# EAGLE board EEZ PSU consolidated r5B13 (EAGLE 6.1), part 1 of 4
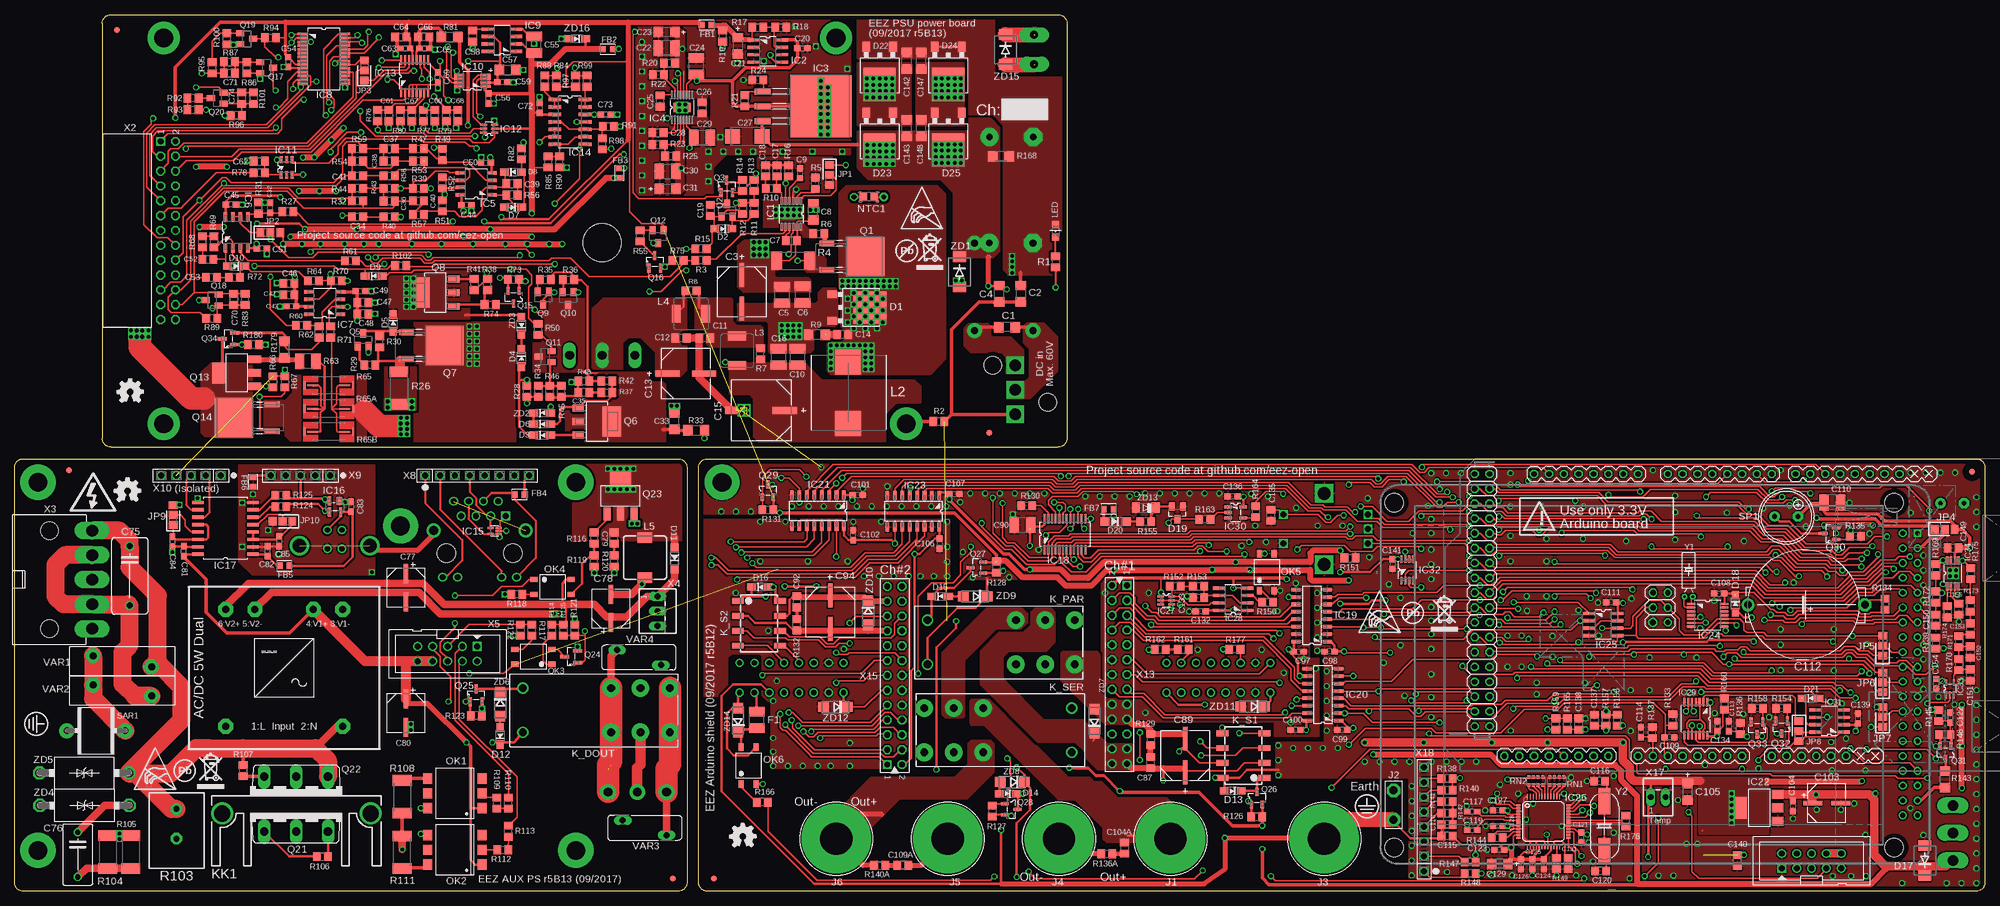
[diagram p12: board, top side]
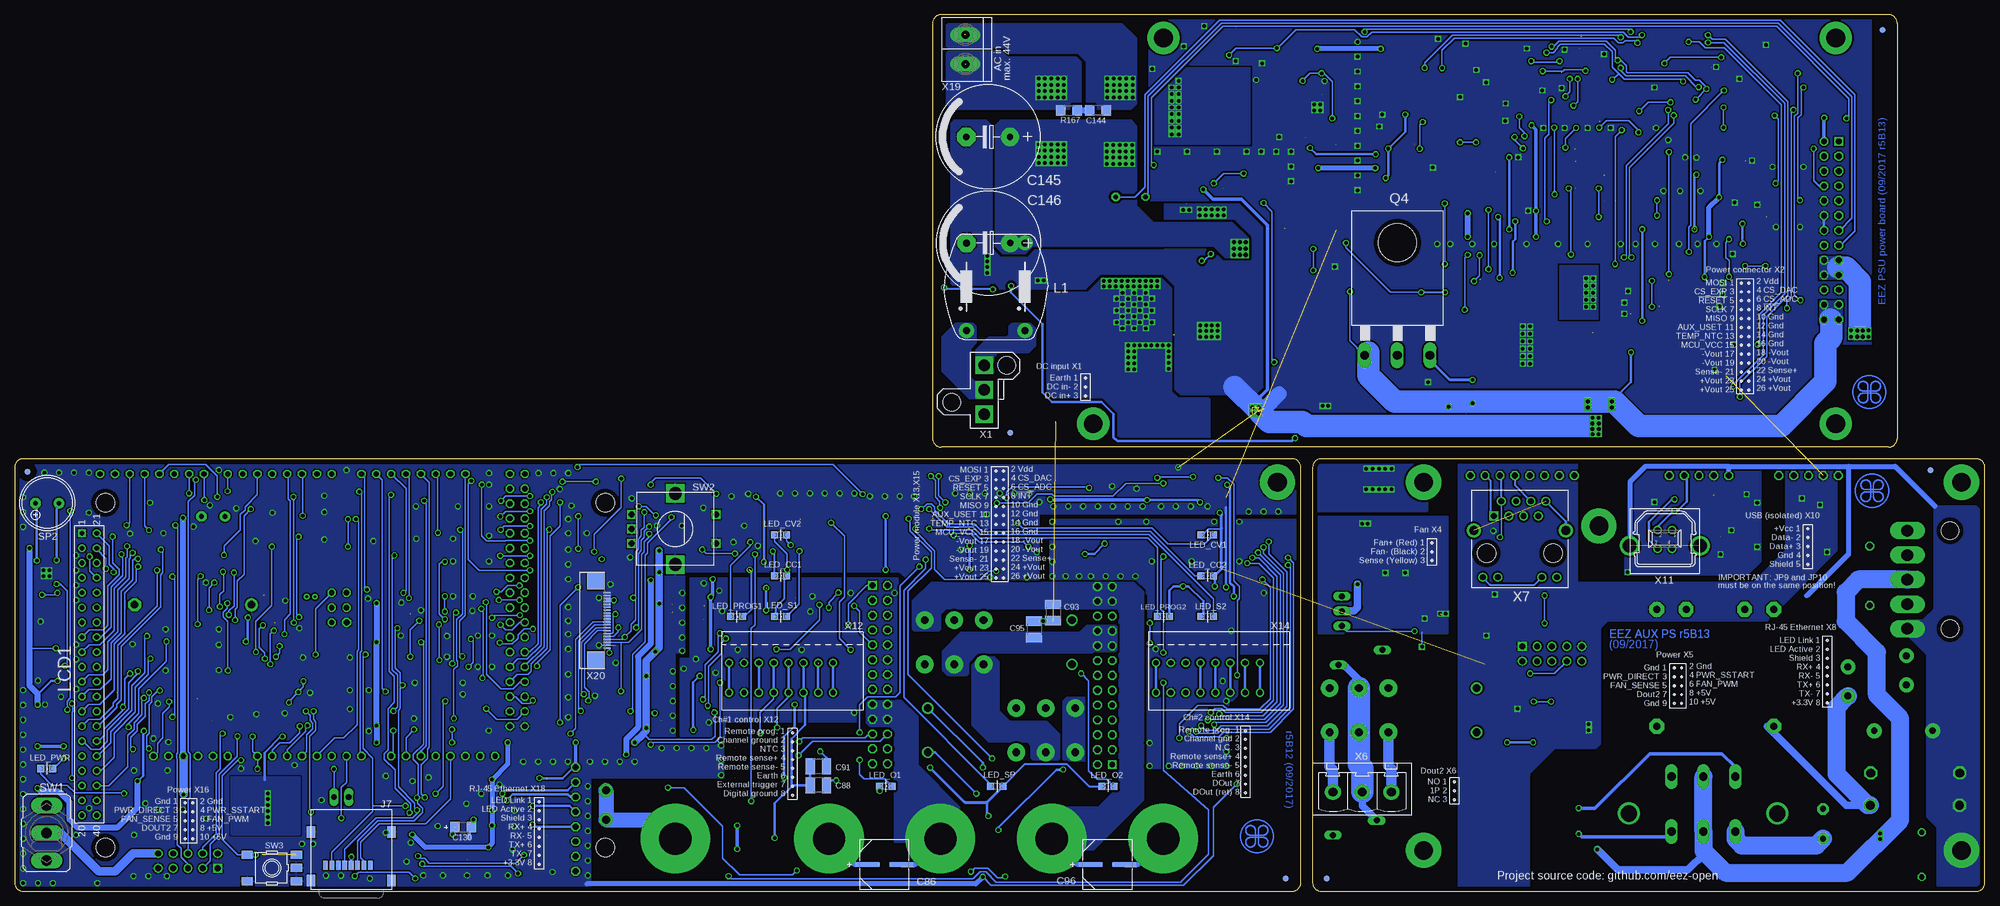
[diagram p13: board, bottom side, seen from below]

Size 337 x 150 mm. Coordinates in mm from the lower left corner, seen from the top.
Outline: 16.5,76 178.5,76 arc90 180,77.5 180,148.5 arc90 178.5,150 16.5,150 arc90 15,148.5 15,77.5 arc90 16.5,76
Outline: 1.5,74 113.5,74 arc-90 115,72.5 115,1.5 arc-90 113.5,0 1.5,0 arc-90 0,1.5 0,72.5 arc-90 1.5,74
Outline: 118.5,74 335.5,74 arc-90 337,72.5 337,1.5 arc-90 335.5,0 118.5,0 arc-90 117,1.5 117,72.5 arc-90 118.5,74
Copper layers (1*16): Top 0.035mm / dielectric 1.5mm / Bottom 0.035mm
Design rules: minimum track width 10mil, minimum drill 0.5mm, track to track 8mil, track to pad 8mil, pad to pad 8mil, via to via 8mil, smd to smd 8mil, copper to edge 30mil, drill to drill 8mil, minimum pad ring 10mil, minimum via ring 8mil, stop-mask expansion 4mil, vias tented up to drill 25mil, thermal gap 10mil
Net classes: 0 default: width 0.254 mm, drill 0.584 mm, clearance 0.254 mm; 1 dgnd: width 0.254 mm, drill 0.584 mm, clearance 0.254 mm; 2 gnd: width 0.254 mm, drill 0.584 mm, clearance 0.254 mm

## Footprints (pad centres in the part's own frame; a part is rotated, then mirrored left to right if it is on the bottom)
C1206 = smd 1.6 x 1.8: 1 -1.4,0; 2 1.4,0
CAPAE830X650N = smd 4.064 x 0.762: 1 -2.87,0; 2 2.87,0
C1210 = smd 1.6 x 2.7: 1 -1.4,0; 2 1.4,0
C0805 = smd 1.3 x 1.5: 1 -0.95,0; 2 0.95,0
C0603 = smd 1.1 x 1: 1 -0.85,0; 2 0.85,0
CAPAE830X1050N = smd 4.064 x 1.092: 1 -3.124,0; 2 3.124,0
PANASONIC_F = smd 4.166 x 1.194: 1 -4.064,0; 2 4.064,0
EC1206 = smd 1.6 x 1.8: + -1.4,0; - 1.4,0
C/6032-28R = smd 2.55 x 2.5: + 2.525,0; - -2.525,0
C102-064X133 = drill 1.016 octagon: 1 -5.08,0; 2 5.08,0
C075-052X106 = drill 0.914 octagon: 1 -3.81,0; 2 3.81,0
CAPAE660X610N = smd 3.251 x 0.762: 1 -2.413,0; 2 2.413,0
SG-R20MM = drill 1.3 pad 2.184 octagon: 1 10.389,0 | drill 1.3 pad 2.184: 2 -9.601,0
ECAP7.5/18 = drill 1.1 pad 3.14: + -3.75,0 | drill 1.1 pad 3.14 octagon: - 3.75,0
TO252 = smd 1.3 x 1.7: 1 -2.285,-5.49; 2 2.285,-5.49 | smd 5.5 x 5.7: 3 0,0.95
SOD323-W = smd 1.5 x 1.2: A 1.45,0; C -1.45,0
SOD123 = smd 1.4 x 1.4: A 1.9,0; C -1.9,0
DO214AA = smd 1.8 x 2.2: A 2.55,0; C -2.55,0
SOT23 = smd 1 x 1.4: 1 -0.95,-1.1; 2 0.95,-1.1; 3 0,1.1
TO252@1 = smd 1.3 x 1.7: 1 -2.285,-5.49; 2 2.285,-5.49 | smd 5.5 x 5.7: 3 0,0.95
F1210 = smd 1.6 x 2.7: 1 -1.4,0; 2 1.4,0
BEAD0603 = smd 1 x 1.1: P$1 -0.85,0; P$2 0.85,0
FIDUCIAL_DUAL = smd 1.016 x 1.016 bottom: B 0,0 | smd 1.016 x 1.016: T 0,0
LTC_05-08-1666 = smd 1.27 x 0.457: 1 -2.235,1.63; 2 -2.235,0.98; 3 -2.235,0.33; 4 -2.235,-0.33; 5 -2.235,-0.98; 6 -2.235,-1.63; 7 2.235,-1.63; 8 2.235,-0.98; 9 2.235,-0.33; 10 2.235,0.33; 11 2.235,0.98; 12 2.235,1.63 | smd 1.753 x 2.946: TP 0,0
SOIC127P600X175-8N = smd 1.981 x 0.559: 1 -2.464,1.905; 2 -2.464,0.635; 3 -2.464,-0.635; 4 -2.464,-1.905; 5 2.464,-1.905; 6 2.464,-0.635; 7 2.464,0.635; 8 2.464,1.905
TO254P1524X483-4N = smd 1.016 x 2.692: 1 -2.54,-9.804; 2 0,-9.804; 3 2.54,-9.804 | smd 10.592 x 10.465: 4 0,0.152
SOP50P490X110-17N = smd 1.397 x 0.279: 1 -2.184,1.753; 2 -2.184,1.245; 3 -2.184,0.762; 4 -2.184,0.254; 5 -2.184,-0.254; 6 -2.184,-0.762; 7 -2.184,-1.245; 8 -2.184,-1.753; 9 2.184,-1.753; 10 2.184,-1.245; 11 2.184,-0.762; 12 2.184,-0.254; 13 2.184,0.254; 14 2.184,0.762; 15 2.184,1.245; 16 2.184,1.753 | smd 1.651 x 2.845: 17 0,0
SOIC127P600X173-8N = smd 1.55 x 0.6: 1 -2.7,1.9; 2 -2.7,0.63; 3 -2.7,-0.64; 4 -2.7,-1.91; 5 2.7,-1.91; 6 2.7,-0.64; 7 2.7,0.63; 8 2.7,1.9
SOP65P780X200-28N = smd 1.651 x 0.432: 1 -3.632,4.216; 2 -3.632,3.581; 3 -3.632,2.921; 4 -3.632,2.286; 5 -3.632,1.626; 6 -3.632,0.965; 7 -3.632,0.33; 8 -3.632,-0.33; 9 -3.632,-0.965; 10 -3.632,-1.626; 11 -3.632,-2.286; 12 -3.632,-2.921; 13 -3.632,-3.581; 14 -3.632,-4.216; 15 3.632,-4.216; 16 3.632,-3.581; 17 3.632,-2.921; 18 3.632,-2.286; 19 3.632,-1.626; 20 3.632,-0.965; 21 3.632,-0.33; 22 3.632,0.33; 23 3.632,0.965; 24 3.632,1.626; 25 3.632,2.286; 26 3.632,2.921; 27 3.632,3.581; 28 3.632,4.216
DGK8-M = smd 1.727 x 0.483: 1 -2.235,0.965; 2 -2.235,0.33; 3 -2.235,-0.33; 4 -2.235,-0.965; 5 2.235,-0.965; 6 2.235,-0.33; 7 2.235,0.33; 8 2.235,0.965
SOT95P280X145-6N = smd 1.27 x 0.559: 1 -1.295,0.94; 2 -1.295,0; 3 -1.295,-0.94; 4 1.295,-0.94; 5 1.295,0; 6 1.295,0.94
SOT65P210X110-6N = smd 1.168 x 0.356: 1 -0.94,0.66; 2 -0.94,0; 3 -0.94,-0.66; 4 0.94,-0.66; 5 0.94,0; 6 0.94,0.66
PW(R-PDSO-G16) = smd 1.6 x 0.35: 1 -2.8,2.3; 2 -2.8,1.65; 3 -2.8,1; 4 -2.8,0.35; 5 -2.8,-0.3; 6 -2.8,-0.95; 7 -2.8,-1.6; 8 -2.8,-2.25; 9 2.8,-2.25; 10 2.8,-1.6; 11 2.8,-0.95; 12 2.8,-0.3; 13 2.8,0.35; 14 2.8,1; 15 2.8,1.65; 16 2.8,2.3
SOIC127P600X175-14N = smd 2.2 x 0.6: 1 -2.591,3.81; 2 -2.591,2.54; 3 -2.591,1.27; 4 -2.591,0; 5 -2.591,-1.27; 6 -2.591,-2.54; 7 -2.591,-3.81; 8 2.591,-3.81; 9 2.591,-2.54; 10 2.591,-1.27; 11 2.591,0; 12 2.591,1.27; 13 2.591,2.54; 14 2.591,3.81
DRL5 = smd 1.016 x 0.305: 1 -0.699,0.5; 2 -0.699,0; 3 -0.699,-0.5; 4 0.699,-0.5; 5 0.699,0.5
SOP192P292X122-4N = smd 0.94 x 1.321: 1 -0.762,-1.016 | smd 0.559 x 1.575: 2 0.965,-1.016; 3 0.965,0.889; 4 -0.965,0.889
SOIC-16W = smd 1.981 x 0.559: 1 -4.699,4.445; 2 -4.699,3.175; 3 -4.699,1.905; 4 -4.699,0.635; 5 -4.699,-0.635; 6 -4.699,-1.905; 7 -4.699,-3.175; 8 -4.699,-4.445; 9 4.699,-4.445; 10 4.699,-3.175; 11 4.699,-1.905; 12 4.699,-0.635; 13 4.699,0.635; 14 4.699,1.905; 15 4.699,3.175; 16 4.699,4.445
SOP63P600X175-24N = smd 1.6 x 0.356: 1 -2.667,3.505; 2 -2.667,2.845; 3 -2.667,2.235; 4 -2.667,1.575; 5 -2.667,0.965; 6 -2.667,0.305; 7 -2.667,-0.305; 8 -2.667,-0.965; 9 -2.667,-1.575; 10 -2.667,-2.235; 11 -2.667,-2.845; 12 -2.667,-3.505; 13 2.667,-3.505; 14 2.667,-2.845; 15 2.667,-2.235; 16 2.667,-1.575; 17 2.667,-0.965; 18 2.667,-0.305; 19 2.667,0.305; 20 2.667,0.965; 21 2.667,1.575; 22 2.667,2.235; 23 2.667,2.845; 24 2.667,3.505
SOIC-16 = smd 1.549 x 0.61: 1 -2.692,4.445; 2 -2.692,3.175; 3 -2.692,1.905; 4 -2.692,0.635; 5 -2.692,-0.635; 6 -2.692,-1.905; 7 -2.692,-3.175; 8 -2.692,-4.445; 9 2.692,-4.445; 10 2.692,-3.175; 11 2.692,-1.905; 12 2.692,-0.635; 13 2.692,0.635; 14 2.692,1.905; 15 2.692,3.175; 16 2.692,4.445
SOT223 = smd 1.5 x 2: 1 -2.3,-3.15; 2 0,-3.15; 3 2.3,-3.15 | smd 3.8 x 2: 4 0,3.15
SOP65P640X120-14N = smd 1.473 x 0.356: 1 -2.819,1.956; 2 -2.819,1.295; 3 -2.819,0.66; 4 -2.819,0; 5 -2.819,-0.66; 6 -2.819,-1.295; 7 -2.819,-1.956; 8 2.819,-1.956; 9 2.819,-1.295; 10 2.819,-0.66; 11 2.819,0; 12 2.819,0.66; 13 2.819,1.295; 14 2.819,1.956
TQFP48-7X7 = smd 0.85 x 0.32: 1 -4.275,2.75; 2 -4.275,2.25; 3 -4.275,1.75; 4 -4.275,1.25; 5 -4.275,0.75; 6 -4.275,0.25; 7 -4.275,-0.25; 8 -4.275,-0.75; 9 -4.275,-1.25; 10 -4.275,-1.75; 11 -4.275,-2.25; 12 -4.275,-2.75; 25 4.275,-2.75; 26 4.275,-2.25; 27 4.275,-1.75; 28 4.275,-1.25; 29 4.275,-0.75; 30 4.275,-0.25; 31 4.275,0.25; 32 4.275,0.75; 33 4.275,1.25; 34 4.275,1.75; 35 4.275,2.25; 36 4.275,2.75 | smd 0.32 x 0.85: 13 -2.75,-4.275; 14 -2.25,-4.275; 15 -1.75,-4.275; 16 -1.25,-4.275; 17 -0.75,-4.275; 18 -0.25,-4.275; 19 0.25,-4.275; 20 0.75,-4.275; 21 1.25,-4.275; 22 1.75,-4.275; 23 2.25,-4.275; 24 2.75,-4.275; 37 2.75,4.275; 38 2.25,4.275; 39 1.75,4.275; 40 1.25,4.275; 41 0.75,4.275; 42 0.25,4.275; 43 -0.25,4.275; 44 -0.75,4.275; 45 -1.25,4.275; 46 -1.75,4.275; 47 -2.25,4.275; 48 -2.75,4.275
SOT95P280X145-5N = smd 1.27 x 0.559: 1 -1.295,0.94; 2 -1.295,0; 3 -1.295,-0.94; 4 1.295,-0.94; 5 1.295,0.94
SOP65P400X130-8N = smd 1.321 x 0.356: 1 -1.829,0.965; 2 -1.829,0.33; 3 -1.829,-0.33; 4 -1.829,-0.965; 5 1.829,-0.965; 6 1.829,-0.33; 7 1.829,0.33; 8 1.829,0.965
SOT65P210X110-5N = smd 1.168 x 0.356: 1 -1.041,0.66; 2 -1.041,0; 3 -1.041,-0.66; 4 1.041,-0.66; 5 1.041,0.66
SOP65P490X110-9N = smd 1.422 x 0.432: 1 -2.184,0.965; 2 -2.184,0.33; 3 -2.184,-0.33; 4 -2.184,-0.965; 5 2.184,-0.965; 6 2.184,-0.33; 7 2.184,0.33; 8 2.184,0.965 | smd 1.575 x 1.88: TP 0,0
BP_5_12 = drill 5.5 pad 11.9: P$1 0,0
PCB_TAB-4.8MM = drill 1.4 pad 2.3 octagon: P$1 -2.54,0; P$2 2.46,0
693072010801 = smd 0.8 x 1.5: 1 7.7,0; 2 6.6,0; 3 5.5,0; 4 4.4,0; 5 3.3,0; 6 2.2,0; 7 1.1,0; 8 0,0 | smd 1.45 x 2: Z1 -2.45,5.7; Z2 11.3,5.7; Z3 -2.45,-2.6; Z4 11.3,-2.6
A0R-JMP = smd 1.5 x 1.3: 1 0,1.7; 2 0,0; 3 0,-1.7
RT-C/016A5_ROUND = drill 1.3 pad 3: 11A 8.83,3.78; 11B 8.83,-3.78; 12A 3.79,3.78; 12B 3.79,-3.78; 14A 13.87,3.78; 14B 13.87,-3.78 | drill 1.3: A1 -11.33,-3.78; A2 -11.33,3.78
G6K-2F = smd 1 x 2: 1 -3.81,-3.6; 2 -1.27,-3.6; 3 1.27,-3.6; 4 3.81,-3.6; 5 3.81,3.6; 6 1.27,3.6; 7 -1.27,3.6; 8 -3.81,3.6
SK145 = drill 2.8: 1 -12.7,0; 2 12.7,0
RN112 = drill 1.2 pad 2.54: 1 -7.5,5; 2 7.5,5; 3 -7.5,-5; 4 7.5,-5
WE-HCI_1350/1365 = smd 4.25 x 4.5: 1 -5.25,0; 2 5.27,0
IHLP-2020BZ-11 = smd 3.048 x 1.524: 1 0,2.515; 2 0,-2.515
DE0704 = smd 2.5 x 1.8: 1 0,3.45; 2 0,-3.45
LCD_TFT_9341_MIRROR = drill 0.8 square: 1 48.26,0 | drill 0.8: 2 45.72,0; 3 43.18,0; 4 40.64,0; 5 38.1,0; 6 35.56,0; 7 33.02,0; 8 30.48,0; 9 27.94,0; 10 25.4,0; 11 22.86,0; 12 20.32,0; 13 17.78,0; 14 15.24,0; 15 12.7,0; 16 10.16,0; 17 7.62,0; 18 5.08,0; 19 2.54,0; 20 0,0; 21 48.26,2.54; 22 45.72,2.54; 23 43.18,2.54; 24 40.64,2.54; 25 38.1,2.54; 26 35.56,2.54; 27 33.02,2.54; 28 30.48,2.54; 29 27.94,2.54; 30 25.4,2.54; 31 22.86,2.54; 32 20.32,2.54; 33 17.78,2.54; 34 15.24,2.54; 35 12.7,2.54; 36 10.16,2.54; 37 7.62,2.54; 38 5.08,2.54; 39 2.54,2.54; 40 0,2.54 | hole 3.2: -5.5,4; 53.5,4; -5.5,89.5; 53.5,89.5
LED_HSMH-C170 = smd 1.2 x 1.2: A 0,1.05; C 0,-1.05
LED_0805 = smd 1.2 x 1.2: A 0,-1.05; C 0,1.05
ARDUINO+ICSP_MIRROR = drill 0.9 octagon: 0 63.5,2.54; 1 60.96,2.54; 2 58.42,2.54; 3 55.88,2.54; 3.3V 35.56,50.8; 4 53.34,2.54; 5 50.8,2.54; 5V 38.1,50.8; 5V(1) 93.98,2.54; 5V(2) 96.52,2.54; 6 48.26,2.54; 7 45.72,2.54; 8 41.656,2.54; 9 39.116,2.54; 10 36.576,2.54; 11 34.036,2.54; 12 31.496,2.54; 13 28.956,2.54; 14 68.58,2.54; 15 71.12,2.54; 16 73.66,2.54; 17 76.2,2.54; 18 78.74,2.54; 19 81.28,2.54; 20 83.82,2.54; 21 86.36,2.54; 22 93.98,5.08; 23 96.52,5.08; 24 93.98,7.62; 25 96.52,7.62; 26 93.98,10.16; 27 96.52,10.16; 28 93.98,12.7; 29 96.52,12.7; 30 93.98,15.24; 31 96.52,15.24; 32 93.98,17.78; 33 96.52,17.78; 34 93.98,20.32; 35 96.52,20.32; 36 93.98,22.86; 37 96.52,22.86; 38 93.98,25.4; 39 96.52,25.4; 40 93.98,27.94; 41 96.52,27.94; 42 93.98,30.48; 43 96.52,30.48; 44 93.98,33.02; 45 96.52,33.02; 46 93.98,35.56; 47 96.52,35.56; 48 93.98,38.1; 49 96.52,38.1; 50 93.98,40.64; 51 96.52,40.64; 52 93.98,43.18; 53 96.52,43.18; A0 50.8,50.8; A1 53.34,50.8; A2 55.88,50.8; A3 58.42,50.8; A4 60.96,50.8; A5 63.5,50.8; A6 66.04,50.8; A7 68.58,50.8; A8 73.66,50.8; A9 76.2,50.8; A10 78.74,50.8; A11 81.28,50.8; A12 83.82,50.8; A13 86.36,50.8; A14 88.9,50.8; A15 91.44,50.8; AREF 23.876,2.54; GND 26.416,2.54; GND1 40.64,50.8; GND2 43.18,50.8; GND3 93.98,45.72; GND4 96.52,45.72; ICSP_+5V 66.04,22.86; ICSP_MISO 63.5,22.86; ICSP_MOSI 66.04,25.4; ICSP_RESET 63.5,27.94; ICSP_SCK 63.5,25.4; RESET 33.02,50.8; VIN 45.72,50.8 | drill 1.016 octagon: ICSP_GND 66.04,27.94
R_0204/5+0805 = smd 1.3 x 1.5: 1 -0.95,0; 2 0.95,0 | drill 0.813 octagon: 1.1 -2.54,0 | drill 0.8 pad 1.422 octagon: 2.1 2.54,0
DIL6-SMD = smd 1.78 x 1.52: 1 -2.54,-4.645; 2 0,-4.645; 3 2.54,-4.645; 4 2.54,4.645; 5 0,4.645; 6 -2.54,4.645
HCPL-181 = smd 0.889 x 1.27: 1 -1.27,-3.175; 2 1.27,-3.175; 3 1.27,3.175; 4 -1.27,3.175
TO229P990X239-3N = smd 0.94 x 2.489: 1 -2.286,-6.401; 3 2.286,-6.401 | smd 6.731 x 6.528: 2 0,0.152
SOT23-BEC = smd 1 x 1.4: B -0.95,-1.1; C 0,1.1; E 0.95,-1.1
SOT103P240X110-3N = smd 1.524 x 0.559: 1 -1.079,1.016; 2 -1.079,-1.016; 3 1.079,0
TO247BH-CLR = drill 1.499 long: D 0,-19.304; G -5.588,-19.304; S 5.588,-19.304 | hole 6.5: 0,0
SOT230P700X180-4N = smd 1.905 x 1.143: 1 -3.2,2.311; 2 -3.2,0; 3 -3.2,-2.311 | smd 3.175 x 5.08: 4 2.565,0
SOT223' = smd 1.219 x 2.235: 1 -2.311,-3.099; 2 0,-3.099; 3 2.311,-3.099 | smd 3.6 x 2.2: 4 0,3.099
SOT95P237X112-3N = smd 1.321 x 0.559: 1 -1.092,0.94; 2 -1.092,-0.94; 3 1.092,0
TOP3S-1 = drill 1.397 long: A1 -5.461,-3.175; A2 0,-3.175; G 5.461,-3.175
R0805 = smd 1.3 x 1.5: 1 -0.95,0; 2 0.95,0
R2512 = smd 1.8 x 3.2: 1 -2.8,0; 2 2.8,0
R1206 = smd 1.6 x 1.803: 1 -1.422,0; 2 1.422,0
R1210 = smd 1.6 x 2.7: 1 -1.4,0; 2 1.4,0
R_2512-4WIRE = smd 0.254 x 1.27: 1 -4.191,0; 2 4.191,0 | smd 1.905 x 0.254: 1S -2.731,0; 2S 2.731,0
R_0913 = drill 1.016 pad 1.93 octagon: 1 -3.556,0; 2 1.524,0
CAY16 = smd 0.5 x 0.65: 1 -1.2,-0.675; 2 -0.4,-0.675; 3 0.4,-0.675; 4 1.2,-0.675; 5 1.2,0.675; 6 0.4,0.675; 7 -0.4,0.675; 8 -1.2,0.675
SAR = drill 1.1 pad 2.54: P$1 0,0; P$2 10,0
SHORT_NOHOLE = smd 0.5 x 0.25 bottom: P$1 0,0.117; P$2 0,-0.117
LD-BZEN-0903 = drill 0.8 pad 1.778 octagon: +B 2,0 | drill 0.8 pad 1.778: -B -2,0
M9040P = drill 1.803 long: 1 0,4.699; 2 0,0; 3 0,-4.699
EC12E_SW = drill 1 square: A -2.5,-7.5; B 2.5,-7.5; C 0,-7.5; D -2.5,7; E 2.5,7 | drill 2.2 square: GND1 -6.1,0; GND2 6.1,0
TACTM-6XN = smd 2.1 x 1.4: 1 -4.2,2.25; 2 4.2,2.25; 3 -4.2,-2.25; 4 4.2,-2.25; 5 -4.2,0
PCB_ACDC_VTX_5W_DUAL = drill 1.2 pad 2.54 octagon: 1 10,-10; 2 10,10; 3 -10,10; 4 -10,5; 5 -10,-5; 6 -10,-10
VARISTOR = drill 1.2 pad 2.54: P$1 -5,0.95; P$2 5,-0.95
VARISTOR_13MM = drill 1.016 long: 1 3.75,-1.27; 2 -3.75,1.27
MINIFIT_39301039 = drill 2 square: 1 0,0; 2 0,-4.2; 3 0,-8.4 | hole 3: 5.55,-2.1; -3.85,-8.4
SSW-113-02-T-D-RA = drill 1 pad 1.5 square: 1 30.48,2.54 | drill 1 pad 1.5 octagon: 2 30.48,0; 3 27.94,2.54; 4 27.94,0; 5 25.4,2.54; 6 25.4,0; 7 22.86,2.54; 8 22.86,0; 9 20.32,2.54; 10 20.32,0; 11 17.78,2.54; 12 17.78,0; 13 15.24,2.54; 14 15.24,0; 15 12.7,2.54; 16 12.7,0; 17 10.16,2.54; 18 10.16,0; 19 7.62,2.54; 20 7.62,0; 21 5.08,2.54; 22 5.08,0; 23 2.54,2.54; 24 2.54,0; 25 0,2.54; 26 0,0
MINIFIT_6659-5 = drill 2 pad 2.54 long: 1 0,-16.8; 2 0,-12.6; 3 0,-8.4; 4 0,-4.2; 5 0,0 | hole 3: -7.3,0; -7.3,-16.8
22-23-2031 = drill 1 long: 1 -2.54,0; 2 0,0; 3 2.54,0
IDC-10PIN = drill 1 pad 1.422 square: 1 -5.08,-1.27 | drill 1 pad 1.422: 2 -5.08,1.27; 3 -2.54,-1.27; 4 -2.54,1.27; 5 0,-1.27; 6 0,1.27; 7 2.54,-1.27; 8 2.54,1.27; 9 5.08,-1.27; 10 5.08,1.27
WR-TBL_3-PIN = drill 1.5 pad 2.7: 1 -5,0; 2 0,0; 3 5,0
RJ45-VERT = drill 1 square: 1 4.445,-5.08 | drill 1: 2 3.175,-7.62; 3 1.905,-5.08; 4 0.635,-7.62; 5 -0.635,-5.08; 6 -1.905,-7.62; 7 -3.175,-5.08; 8 -4.445,-7.62; 9 6.325,5.38; 10 3.785,5.38; 11 -3.785,5.38; 12 -6.325,5.38 | drill 1.6: SH1 7.875,-2.62; SH2 -7.875,-2.62 | hole 3.2: -5.715,1.27; 5.715,1.27
HEADER_8-PIN = drill 1 pad 1.5 octagon: 1 -8.89,0; 2 -6.35,0; 3 -3.81,0; 4 -1.27,0; 5 1.27,0; 6 3.81,0; 7 6.35,0; 8 8.89,0
SSW-105-02-S-S = drill 1 pad 1.5 octagon: 1 -5.08,0; 2 -2.54,0; 3 0,0; 4 2.54,0; 5 5.08,0
KUSBVX-BS1N = drill 0.9 pad 1.422: 1 1.25,2.7; 2 -1.25,2.7; 3 -1.25,-0.5; 4 1.25,-0.5 | drill 2.3 pad 2.7: M1 -6.02,0; M2 6.02,0
MC000006_MIRROR = drill 0.9: 1 0,0; 1.1 0,-5.08; 2 -2.54,0; 2.1 -2.54,-5.08; 3 -5.08,0; 3.1 -5.08,-5.08; 4 -7.62,0; 4.1 -7.62,-5.08; 5 -10.16,0; 5.1 -10.16,-5.08; 6 -12.7,0; 6.1 -12.7,-5.08; 7 -15.24,0; 7.1 -15.24,-5.08; 8 -17.78,0; 8.1 -17.78,-5.08
TSW-113-07-F-D = drill 1 pad 1.5 square: 1 30.48,0 | drill 1 pad 1.5 octagon: 2 30.48,2.54; 3 27.94,0; 4 27.94,2.54; 5 25.4,0; 6 25.4,2.54; 7 22.86,0; 8 22.86,2.54; 9 20.32,0; 10 20.32,2.54; 11 17.78,0; 12 17.78,2.54; 13 15.24,0; 14 15.24,2.54; 15 12.7,0; 16 12.7,2.54; 17 10.16,0; 18 10.16,2.54; 19 7.62,0; 20 7.62,2.54; 21 5.08,0; 22 5.08,2.54; 23 2.54,0; 24 2.54,2.54; 25 0,0; 26 0,2.54
22-23-2021 = drill 1 long: 1 -1.27,0; 2 1.27,0
TBLOCK5.0_2 = drill 1.35 pad 2.54 long: 1 0,0; 2 0,-5
FPC-20_ROTATED = smd 0.3 x 1.2: 1 4.75,2.217; 2 4.25,2.217; 3 3.75,2.217; 4 3.25,2.217; 5 2.75,2.217; 6 2.25,2.217; 7 1.75,2.217; 8 1.25,2.217; 9 0.75,2.217; 10 0.25,2.217; 11 -0.25,2.217; 12 -0.75,2.217; 13 -1.25,2.217; 14 -1.75,2.217; 15 -2.25,2.217; 16 -2.75,2.217; 17 -3.25,2.217; 18 -3.75,2.217; 19 -4.25,2.217; 20 -4.75,2.217 | smd 2.7 x 3: Z1 -6.68,0.318; Z2 6.68,0.318
R26_XTAL = drill 0.5: 1 -0.7,0; 2 0.7,0
HC-49/4H = smd 4.5 x 2: 1 -4.25,0; 2 4.25,0
DO201-BIDIR = drill 1.499 octagon: A 7.62,0; C -7.62,0
DO214AC = smd 1.8 x 1.7: A 2.05,0; C -2.05,0
MINIMELF = smd 1.4 x 1.8: A 1.7,0; C -1.7,0

## Placement (x,y rotation side)
C1  4n7/100V  [C1206]  169.73,96.52 180 top
C2  4n7/100V  [C1206]  172.08,102.23 270 top
C3  50SVPF18M  [CAPAE830X650N]  124.4,102.55 270 top
C4  4n7/100V  [C1206]  168.4,102.23 90 top
C5  4u7/100V  [C1210]  131.25,102.04 270 top
C6  4u7/100V  [C1210]  134.75,102.11 270 top
C7  470n  [C0805]  132.84,111.32 0 top
C8  1u/100V  [C1206]  136.59,116.27 90 top
C9  100n  [C0603]  134.37,122.87 270 top
C10  10u  [C1210]  133.92,91.44 90 top
C11  1u  [C0805]  118.05,94.68 180 top
C12  n.c.  [C0805]  113.98,94.68 0 top
C13  EEEFK1H470P  [CAPAE830X1050N]  114.81,88.58 0 top
C14  470p  [C0805]  141.67,95.25 180 top
C15  EEEFK1J101P  [PANASONIC_F]  127.7,82.3 180 top
C16  10u  [C1210]  130.68,91.44 90 top
C17  120p  [C0805]  130.43,123.25 90 top
C18  4n7  [C0805]  128.46,123.25 90 top
C19  470p  [C0805]  119,116.52 270 top
C20  100n  [C0603]  134.75,144.27 0 top
C21  4u7  [EC1206]  123.7,144.65 270 top
C22  10u  [C1210]  111.5,144.27 180 top
C23  10u  [EC1206]  111.5,147 180 top
C24  10u  [C1210]  116.58,141.16 90 top
C25  10n  [C0805]  110.43,135.19 90 top
C26  1u  [C0805]  117.6,134.05 270 top
C27  1uF/50V Tant.  [C/6032-28R]  125.35,129.16 0 top
C28  10n  [C0805]  110.04,129.79 0 top
C29  10u  [C1210]  117.6,128.97 0 top
C30  10u  [C1210]  111.7,123.19 0 top
C31  10u  [EC1206]  111.7,120.21 0 top
C32  100n  [C0603]  43.69,116.9 90 top
C33  1u/100V  [C1206]  112.84,80.45 90 top
C34  47p  [C0805]  58.67,115.38 0 top
C35  10n  [C0805]  97.34,85.34 180 top
C36  2n2  [C0805]  64.07,118.11 0 top
C37  2n2  [C0805]  64.07,127.06 0 top
C38  2n2  [C0805]  64.07,124.9 180 top
C39  120p  [C0805]  85.09,121.09 0 top
C40  2n2  [C0805]  69.09,118.11 0 top
C41  47p  [C0805]  58.67,122.42 0 top
C42  10n  [C0805]  46.93,102.04 0 top
C43  100n  [C0603]  47.31,100.08 180 top
C44  100n  [C0603]  77.28,117.41 180 top
C45  100n  [C0603]  37.02,117.47 180 top
C46  1u  [C0805]  46.93,104.01 0 top
C47  10n  [C0805]  59.56,100.71 180 top
C48  1u  [C0805]  59.56,98.76 180 top
C49  100n  [C0603]  59.18,102.68 0 top
C50  100n  [C0603]  80.64,124.65 0 top
C51  100n  [C0603]  42.29,109.98 180 top
C52  1n  [C0805]  33.08,108.14 0 top
C53  1n  [C0805]  33.65,105.03 0 top
C54  100n  [C0603]  46.8,141.86 270 top
C55  10u  [C1210]  88.84,144.84 90 top
C56  100n  [C0603]  81.09,135.64 90 top
C57  10u  [EC1206]  84.33,140.53 0 top
C58  1u  [C0805]  78.36,146.3 270 top
C59  100n  [C0603]  83.44,138.43 180 top
C60  3n3  [C0805]  71.88,132.72 90 top
C61  3n3  [C0805]  64.01,132.72 270 top
C62  n.c.  [C0805]  41.85,124.9 0 top
C63  100n  [C0603]  66.8,144.21 0 top
C64  1u  [C0805]  66.04,146.18 0 top
C65  100n  [C0603]  70.1,144.21 180 top
C66  1u  [C0805]  69.98,146.18 180 top
C67  3n3  [C0805]  67.94,132.72 90 top
C68  3n3  [C0805]  75.82,132.72 90 top
C69  100n  [C0603]  72.39,139.26 90 top
C70  10n  [C0805]  37.46,101.28 270 top
C71  2n2  [C0805]  36.77,139.95 180 top
C72  100n  [C0603]  89.79,134.05 270 top
C73  100n  [C0603]  101.15,132.91 180 top
C74  10n  [C0805]  38.86,135.7 90 top
C75  6n8 (X1)  [C102-064X133]  19.68,53.98 270 top
C76  47n/400V  [C075-052X106]  10.79,6.29 270 top
C77  47u  [CAPAE660X610N]  66.93,51.94 270 top
C78  220u  [CAPAE660X610N]  101.98,48.39 90 top
C79  47n  [C0805]  102.55,60.45 90 top
C80  47u  [CAPAE660X610N]  66.93,30.48 270 top
C81  100n  [C0603]  28.95,58.17 90 top
C82  100n  [C0603]  43.31,58.17 90 top
C83  100n  [C0603]  57.53,65.79 270 top
C84  100n  [C0603]  26.99,59.82 270 top
C85  100n  [C0603]  45.27,59.88 270 top
C86  50SVPF18M  [CAPAE830X650N]  188.23,4.57 0 bottom
C87  470n  [C0805]  194.31,22.03 90 top
C88  4n7/100V  [C1210]  199.52,18.16 180 bottom
C89  UWT1H220MCL  [CAPAE830X650N]  200.21,23.24 90 top
C90  10u  [C1210]  172.4,62.67 180 top
C91  4n7/100V  [C1210]  199.52,21.4 0 bottom
C92  470n  [C0805]  133.79,49.53 270 top
C93  4n7/100V  [C1210]  159.38,47.69 270 bottom
C94  UWT1H220MCL  [CAPAE830X650N]  139.51,47.75 270 top
C95  4n7/100V  [C1210]  162.62,44.83 270 bottom
C96  50SVPF18M  [CAPAE830X650N]  150.07,4.57 0 bottom
C97  100n  [C0603]  219.65,41.02 0 top
C98  100n  [C0603]  224.92,41.02 180 top
C99  100n  [C0603]  227.07,27.62 180 top
C100  100n  [C0603]  219.07,27.62 180 top
C101  100n  [C0603]  144.21,67.82 0 top
C102  100n  [C0603]  143.45,60.96 90 top
C103  47u  [CAPAE660X610N]  309.94,15.13 0 top
C104  100n  [C0603]  304.16,14.61 270 top
C104A  1u  [C0805]  189.82,7.43 270 top
C105  10u  [EC1206]  286.13,17.02 270 top
C106  100n  [C0603]  158.18,59.5 270 top
C107  100n  [C0603]  160.72,68.01 0 top
C108  100n  [C0603]  291.54,50.99 0 top
C109  100n  [C0603]  283.03,26.35 180 top
C109A  1u  [C0805]  151.89,4.45 180 top
C110  10u  [C1210]  310.91,66.55 180 top
C111  100n  [C0603]  273.06,49.4 180 top
C112  EECS5R5H105  [SG-R20MM]  306.08,49.02 0 top
C113  100n  [C0603]  293.19,28.26 270 top
C114  100n  [C0603]  278.14,27.24 270 top
C115  22n  [C0805]  244.99,9.46 180 top
C116  18p  [C0805]  271.09,18.86 180 top
C117  6n8  [C0603]  249.31,13.65 0 top
C118  10n  [C0805]  244.99,11.43 180 top
C119  6n8  [C0603]  249.31,10.48 0 top
C120  18p  [C0805]  271.28,3.49 180 top
C121  100n  [C0603]  267.98,9.21 90 top
C122  100n  [C0603]  331.09,29.71 270 top
C123  100n  [C0603]  253.95,7.11 180 top
C124  100n  [C0603]  261.57,4.64 270 top
C125  100n  [C0603]  259.6,4.64 270 top
C126  100n  [C0603]  257.63,4.64 270 top
C127  100n  [C0603]  253.69,13.84 180 top
C128  100n  [C0603]  253.69,11.18 180 top
C129  10u  [EC1206]  254.01,4.7 180 top
C130  4u7  [EC1206]  260.3,10.99 0 bottom
C131  10n  [C0805]  265.7,4.76 90 top
C132  100n  [C0603]  202.88,47.88 180 top
C133  47n  [C0805]  202.5,50.23 0 top
C134  100n  [C0603]  291.22,28.26 270 top
C135  10n  [C0805]  214.88,64.33 90 top
C136  100n  [C0603]  208.34,67.56 180 top
C137  10n  [C0805]  270.2,29.27 270 top
C138  10n  [C0805]  267.54,28.64 90 top
C139  100n  [C0603]  315.29,29.59 270 top
C140  47n  [C0805]  294.64,5.28 90 top
C141  100n  [C0603]  235.65,56.01 270 top
C142  1n  [C1206]  152.59,142.11 90 top
C143  1n  [C1206]  152.59,130.56 90 top
C144  n.c  [C1206]  151.7,133.6 180 bottom
C145  2m2  [ECAP7.5/18]  170.5,129.1 180 bottom
C146  2m2  [ECAP7.5/18]  170.43,110.93 180 bottom
C147  1n  [C1206]  155.07,142.11 90 top
C148  1n  [C1206]  155.07,130.56 90 top
C149  1u  [C0805]  331.53,58.74 0 top
C150  470n  [C0805]  328.61,46.42 270 top
C151  4n7  [C0805]  334.52,37.02 270 top
C152  4n7  [C0805]  334.52,40.96 270 top
C153  470n  [C0805]  334.52,44.89 270 top
C154  100n  [C0603]  328.68,35.5 90 top
C155  220n  [C0805]  332.55,48.26 90 top
D1  STPS15H100  [TO252]  145.35,99.89 270 top
D2  BAS316  [SOD323-W]  121.22,113.35 180 top
D3  BAS316  [SOD323-W]  90.23,78.04 0 top
D4  BAS316  [SOD323-W]  86.68,91.25 270 top
D5  BAS316  [SOD323-W]  64.77,97.28 270 top
D6  BAS316  [SOD323-W]  90.23,79.95 0 top
D7  BAS316  [SOD323-W]  85.28,117.03 180 top
D8  BAS316  [SOD323-W]  85.22,123.06 0 top
D9  BAS316  [SOD323-W]  61.4,105.28 0 top
D10  BAS316  [SOD323-W]  37.91,106.93 180 top
D11  SKL16  [SOD123]  112.9,56.96 90 top
D12  BAS316  [SOD323-W]  83.06,26.54 90 top
D13  BAS316  [SOD323-W]  208.35,17.17 180 top
D14  BAS316  [SOD323-W]  169.88,16.7 180 top
D15  BAS316  [SOD323-W]  158.3,50.48 0 top
D16  BAS316  [SOD323-W]  127.51,52.07 0 top
D17  SMBJ5.0A-TR  [DO214AA]  326.72,5.27 90 top
D18  BAS316  [SOD323-W]  294.33,49.21 270 top
D19  BAT54S  [SOT23]  198.88,64.77 180 top
D20  SKL16  [SOD123]  188.34,63.25 180 top
D21  BAS316  [SOD323-W]  307.16,33.02 0 top
D22  STPS15H100  [TO252@1]  147.95,139 180 top
D23  STPS15H100  [TO252@1]  147.95,127.76 180 top
D24  STPS15H100  [TO252@1]  159.7,139 180 top
D25  STPS15H100  [TO252@1]  159.7,127.76 180 top
EEZ_SIGNATURE  SIGNATURESMALL  [SIGNATURE_5MM]  19.74,85.42 180 top
EEZ_SIGNATURE1  SIGNATURESMALL  [SIGNATURE_5MM]  19.3,68.53 180 top
EEZ_SIGNATURE2  SIGNATURESMALL  [SIGNATURE_5MM]  124.53,9.42 180 top
F1  50mA  [F1210]  126.94,29.34 90 top
FB1  60R@100MHz  [BEAD0603]  118.36,148.21 180 top
FB2  60R@100MHz  [BEAD0603]  101.47,144.08 180 top
FB3  60R@100MHz  [BEAD0603]  103.44,122.87 270 top
FB4  60R@100MHz  [BEAD0603]  86.36,67.88 0 top
FB5  60R@100MHz  [BEAD0603]  46.16,55.69 180 top
FB6  60R@100MHz  [BEAD0603]  40.77,70.04 270 top
FB7  60R@100MHz  [BEAD0603]  187.13,65.41 180 top
FM1  FIDUCIAL_2  [FIDUCIAL_DUAL]  166.69,78.42 0 top
FM2  FIDUCIAL_2  [FIDUCIAL_DUAL]  17.52,147.38 0 top
FM3  FIDUCIAL_2  [FIDUCIAL_DUAL]  9.27,72.01 0 top
FM4  FIDUCIAL_2  [FIDUCIAL_DUAL]  112.58,2.22 0 top
FM5  FIDUCIAL_2  [FIDUCIAL_DUAL]  334.78,71.82 0 top
FM6  FIDUCIAL_2  [FIDUCIAL_DUAL]  119.57,2.22 0 top
IC1  LTC3864EMSE#PBF  [LTC_05-08-1666]  132.84,115.89 270 top
IC2  LP2951SO8  [SOIC127P600X175-8N]  128.84,143.76 0 top
IC3  TL783CKTTR  [TO254P1524X483-4N]  137.73,134.3 270 top
IC4  LTC3260EMSE#PBF  [SOP50P490X110-17N]  114.17,134.11 90 top
IC5  TL072D  [SOIC127P600X173-8N]  78.93,121.03 180 top
IC6  TL072D  [SOIC127P600X173-8N]  37.97,112.71 90 top
IC7  LTC2050HVCS8#PBF  [SOIC127P600X173-8N]  53.02,100.65 180 top
IC8  MCP23S17-E/SS  [SOP65P780X200-28N]  52.89,142.43 0 top
IC9  REF5025AIDG4  [SOIC127P600X175-8N]  83.37,145.61 180 top
IC10  DAC8552IDGKTG4  [DGK8-M]  78.29,138.68 180 top
IC11  ADG465SOT-23  [SOT95P280X145-6N]  46.54,123.89 90 top
IC12  TS5A9411DCKT  [SOT65P210X110-6N]  81.15,130.49 180 top
IC13  ADS1120IPWR  [PW(R-PDSO-G16)]  68.45,139.45 90 top
IC14  LP339D  [SOIC127P600X175-14N]  95,131.64 0 top
IC15  TPD4E002DRL  [DRL5]  82.1,61.66 180 top
IC16  TPD2E001DZDR  [SOP192P292X122-4N]  54.8,65.79 180 top
IC17  ADUM3160BRWZ  [SOIC-16W]  36.07,62.1 180 top
IC18  TLC5925IDBQR  [SOP63P600X175-24N]  179.64,61.09 90 top
IC19  Si8641EC-B-IS1  [SOIC-16]  221.87,47.18 180 top
IC20  SI8651EC-B-IS1  [SOIC-16]  223.77,33.66 180 top
IC21  SI8651EC-B-IS1  [SOIC-16]  137.41,65.09 270 top
IC22  LD1117ADT33TR  [SOT223]  298.4,14.29 90 top
IC23  Si8641EC-B-IS1  [SOIC-16]  153.73,65.02 270 top
IC24  PCA21125T/Q900/1,1  [SOP65P640X120-14N]  289.57,47.24 0 top
IC25  AT25256B-SSHL-B  [SOIC127P600X175-8N]  271.73,45.66 0 top
IC26  W5500  [TQFP48-7X7]  261.5,11.94 0 top
IC27  BC857BS  [SOT65P210X110-6N]  196.98,49.78 0 top
IC28  TLC555  [SOIC127P600X175-8N]  208.41,49.97 180 top
IC29  SN74LVC08APWR  [SOP65P640X120-14N]  287.54,29.53 270 top
IC30  SN74LV1T34DBVR  [SOT95P280X145-5N]  208.85,64.83 0 top
IC31  TPS3705-33D  [SOIC127P600X175-8N]  310.4,29.15 180 top
IC32  SN74LVC2G02DCTR  [SOP65P400X130-8N]  238.19,54.99 90 top
IC33  74LVC1G125GW.125  [SOT65P210X110-5N]  331.02,34.67 90 top
IC34  TPA6205A1DGN  [SOP65P490X110-9N]  331.53,54.42 90 top
J1  BS-244DSM-R  [BP_5_12]  197.7,9 0 top
J2  1-726388-2  [PCB_TAB-4.8MM]  235.84,14.8 90 top
J3  BS-244DSM-G  [BP_5_12]  224,9 0 top
J4  BS-244DSM-B  [BP_5_12]  178.65,9 0 top
J5  BS-244DSM-R  [BP_5_12]  159.6,9 0 top
J6  BS-244DSM-B  [BP_5_12]  140.55,9 0 top
J7  693072010801  [693072010801]  283.84,4.45 0 bottom
JP1  0R-JUMPA  [A0R-JMP]  139.38,122.56 180 top
JP2  0R-JUMPA  [A0R-JMP]  43.75,112.71 90 top
JP3  0R-JUMPA  [A0R-JMP]  59.82,140.46 0 top
JP4  0R-JUMPA  [A0R-JMP]  330.14,61.91 90 top
JP5  0R-JUMPA  [A0R-JMP]  319.54,42.04 0 top
JP6  0R-JUMPA  [A0R-JMP]  319.54,35.75 0 top
JP7  0R-JUMPA  [A0R-JMP]  319.54,29.84 0 top
JP8  0R-JUMPA  [A0R-JMP]  305.19,27.43 180 top
JP9  0R-JUMPA  [A0R-JMP]  27.11,64.39 180 top
JP10  0R-JUMPA  [A0R-JMP]  45.85,63.31 270 top
K_DOUT  RT424005  [RT-C/016A5_ROUND]  98.23,30.99 0 top
K_PAR  RT424005  [RT-C/016A5_ROUND]  167.48,42.61 0 top
K_S1  G6K-2F-5DC  [G6K-2F]  210.18,23.24 90 top
K_S2  G6K-2F-5DC  [G6K-2F]  127.32,45.85 270 top
K_SER  RT424005  [RT-C/016A5_ROUND]  169.45,27.56 180 top
KK1  SK 145/37,5  [SK145]  48.2,13.34 180 top
L1  RN112-4-02  [RN112]  169.18,103.44 90 bottom
L2  7443551331  [WE-HCI_1350/1365]  142.56,85.28 270 top
L3  IHLP2020CZER3R3M11  [IHLP-2020BZ-11]  123.57,92.52 180 top
L4  IHLP2020CZER3R3M11  [IHLP-2020BZ-11]  115.7,98.81 270 top
L5  470u  [DE0704]  107.82,57.09 180 top
LCD1  TFT_320QVT  [LCD_TFT_9341_MIRROR]  325.5,13 90 top
LED  n.c.  [LED_HSMH-C170]  178.05,113 180 top
LED_CC1  HSMH-C170  [LED_HSMH-C170]  206,54 270 bottom
LED_CC2  HSMH-C170  [LED_HSMH-C170]  133,54 270 bottom
LED_CV1  HSMY-C170  [LED_0805]  133,61 270 bottom
LED_CV2  HSMY-C170  [LED_0805]  206,61 270 bottom
LED_O1  HSMG-C170  [LED_0805]  188,18 270 bottom
LED_O2  HSMG-C170  [LED_0805]  150,18 270 bottom
LED_PROG1  HSMH-C170  [LED_HSMH-C170]  213.5,47 270 bottom
LED_PROG2  HSMH-C170  [LED_HSMH-C170]  140.5,47 270 bottom
LED_PWR  HSMD-C170  [LED_0805]  331.52,21 270 bottom
LED_S1  HSMY-C170  [LED_0805]  206,47 270 bottom
LED_S2  HSMY-C170  [LED_0805]  133,47 270 bottom
LED_SP  HSMH-C170  [LED_HSMH-C170]  169,18 270 bottom
MCU  Arduino Due  [ARDUINO+ICSP_MIRROR]  346.27,73.95 180 top
NTC1  10K/Beta:3570K  [R_0204/5+0805]  146.11,118.81 0 top
OK1  MOC3052  [DIL6-SMD]  75.31,16.76 90 top
OK2  MOC3062  [DIL6-SMD]  75.31,7.11 90 top
OK3  HCPL-181  [HCPL-181]  88.71,40.13 90 top
OK4  HCPL-181  [HCPL-181]  92.01,52.07 270 top
OK5  HCPL-181  [HCPL-181]  214.18,54.61 0 top
OK6  HCPL-181  [HCPL-181]  125.54,21.53 0 top
Q1  IRFR5305  [TO229P990X239-3N]  145.35,108.58 270 top
Q2  MMBT5401  [SOT23-BEC]  121.86,116.52 0 top
Q3  2N7002  [SOT103P240X110-3N]  121.79,120.59 90 top
Q4  IRFP250N  [TO247BH-CLR]  100.5,111 0 top
Q5  BC857C  [SOT23-BEC]  59.63,94.36 0 top
Q6  BCP56-16.115  [SOT230P700X180-4N]  99.57,80.39 0 top
Q7  IRFR5305  [TO229P990X239-3N]  73.41,93.37 270 top
Q8  BCP56-16.115  [SOT230P700X180-4N]  71.94,102.43 180 top
Q9  MMBT5401  [SOT23-BEC]  90.42,101.47 180 top
Q10  MMBT5401  [SOT23-BEC]  94.68,101.41 180 top
Q11  MMBT5551  [SOT23-BEC]  90.74,91.5 90 top
Q12  MMBT5551  [SOT23-BEC]  110.04,112.01 180 top
Q13  IRLL2705PBF  [SOT223']  37.97,88.71 90 top
Q14  IRFR48ZPBF  [TO229P990X239-3N]  37.65,81.03 90 top
Q15  IRLML2246TRPBF  [SOT95P237X112-3N]  85.34,101.66 270 top
Q16  2N7002  [SOT103P240X110-3N]  109.47,107.7 90 top
Q17  MMBT5551  [SOT23-BEC]  43.12,140.91 270 top
Q18  MMBT5401  [SOT23-BEC]  33.78,101.16 90 top
Q19  MMBT5551  [SOT23-BEC]  39.69,145.86 270 top
Q20  MMBT5551  [SOT23-BEC]  34.67,135.7 90 top
Q21  BTA26-600  [TOP3S-1]  48.13,13.4 0 top
Q22  BTA26-600  [TOP3S-1]  48.13,16.45 180 top
Q23  IRLL2705PBF  [SOT223']  103.63,67.63 0 top
Q24  2N7002  [SOT103P240X110-3N]  95.19,40.13 180 top
Q25  2N7002  [SOT103P240X110-3N]  78.93,33.53 90 top
Q26  IRLML2246TRPBF  [SOT95P237X112-3N]  212.47,15.94 90 top
Q27  IRLML2246TRPBF  [SOT95P237X112-3N]  164.59,55.37 180 top
Q28  IRLML2246TRPBF  [SOT95P237X112-3N]  170.45,14.03 0 top
Q29  IRLML2246TRPBF  [SOT95P237X112-3N]  128.84,68.52 90 top
Q30  2N7002  [SOT103P240X110-3N]  310.46,61.21 180 top
Q31  IRLML2246TRPBF  [SOT95P237X112-3N]  330.28,23.75 270 top
Q32  2N7002  [SOT103P240X110-3N]  302.21,28.07 270 top
Q33  2N7002  [SOT103P240X110-3N]  298.02,27.94 270 top
Q34  2N7002  [SOT103P240X110-3N]  36.58,94.55 180 top
R1  n.c.  [R0805]  178.05,107.7 270 top
R2  n.c.  [R0805]  158.05,80.39 0 top
R3  10K  [R0805]  117.41,107.95 180 top
R4  R010/2W  [R2512]  133.16,107.89 0 top
R5  47K  [R0805]  136.97,121.16 90 top
R6  1R  [R0805]  137.54,112.52 0 top
R7  100R  [R0805]  127.57,91.95 90 top
R8  100R  [R0805]  115.7,102.74 180 top
R9  10R  [R1206]  137.22,95.25 0 top
R10  10K  [R0805]  129.41,120.27 0 top
R11  10K  [R0805]  126.49,116.84 270 top
R12  100K  [R0805]  124.52,116.84 270 top
R13  316K  [R0805]  126.49,120.78 90 top
R14  n.c.  [R0805]  124.52,120.78 270 top
R15  100K  [R0805]  117.41,109.92 180 top
R16  4K7  [R0805]  132.4,123.25 90 top
R17  16K  [R0805]  127.13,147.83 0 top
R18  5K1  [R0805]  131.06,147.83 0 top
R19  10K  [R0805]  121.09,146.3 270 top
R20  316K  [R0805]  112.01,141.67 180 top
R21  220R  [R0805]  124.9,135.25 90 top
R22  100K  [R0805]  110.11,139.7 180 top
R23  100K  [R0805]  110.04,127.76 0 top
R24  1K8  [R0805]  127.13,138.81 180 top
R25  316K  [R0805]  112.2,125.79 0 top
R26  2R2/2W  [R2512]  65.72,86.11 270 top
R27  10K  [R0805]  46.73,116.27 180 top
R28  1K  [R0805]  87.63,85.53 270 top
R29  2K2  [R0805]  60.77,90.04 180 top
R30  2K2  [R0805]  62.42,94.04 90 top
R31  220R  [R0805]  41.72,116.9 90 top
R32  n.c.  [R0805]  58.67,118.11 180 top
R33  10R  [R1206]  116.58,78.87 180 top
R34  16K  [R0805]  89.6,85.53 270 top
R35  220R  [R0805]  90.8,104.65 0 top
R36  220R  [R0805]  94.74,104.65 0 top
R37  470R  [R0805]  101.28,85.34 0 top
R38  1K  [R0805]  80.9,103.82 90 top
R39  7K5 0.1%  [R0805]  69.09,120.27 180 top
R40  10K  [R0805]  64.07,115.38 0 top
R41  220R  [R0805]  78.61,103.82 270 top
R42  100R  [R0805]  101.28,87.31 180 top
R43  100K 0.1%  [R0805]  64.07,120.27 180 top
R44  24K 0.1%  [R0805]  58.67,120.27 180 top
R45  2K2  [R0805]  93.53,85.53 90 top
R46  750R  [R0805]  91.57,85.53 90 top
R47  220R  [R0805]  69.09,127.06 0 top
R48  51K  [R0805]  97.34,87.31 0 top
R49  10K  [R0805]  73.15,126.05 270 top
R50  470R  [R0805]  89.53,96.14 270 top
R51  10K  [R0805]  73.15,117.3 270 top
R52  7K5 0.1%  [R0805]  73.15,121.22 90 top
R53  100K 0.1%  [R0805]  69.09,124.9 180 top
R54  24K 0.1%  [R0805]  58.67,124.9 180 top
R55  1K8  [R0805]  107,112.14 90 top
R56  0R  [R0805]  85.09,119.13 180 top
R57  220R  [R0805]  69.09,115.76 0 top
R58  10K  [R0805]  64.07,122.42 0 top
R59  n.c.  [R0805]  58.67,127.06 0 top
R60  3K9 0.1%  [R0805]  49.08,96.84 0 top
R61  2K2  [R0805]  57.41,107.87 180 top
R62  82R 0.1%  [R0805]  52.07,95.69 90 top
R63  0R082  [R1210]  50.16,90.68 180 top
R64  10K  [R0805]  51.11,104.46 180 top
R65  0R030  [R_2512-4WIRE]  53.72,86.55 180 top
R65A  0R030  [R_2512-4WIRE]  53.72,82.55 180 top
R65B  0R030  [R_2512-4WIRE]  53.72,78.61 180 top
R66  47K  [R0805]  44.2,87.19 270 top
R67  47K  [R0805]  46.23,87.19 270 top
R68  1K  [R0805]  32.13,111.12 90 top
R69  10K  [R0805]  34.1,111.12 270 top
R70  3K9 0.1%  [R0805]  55.05,104.46 180 top
R71  82R 0.1%  [R0805]  54.04,95.69 90 top
R72  10K  [R0805]  37.59,105.03 0 top
R73  100K  [R0805]  85.34,104.71 0 top
R74  10K  [R0805]  81.34,100.39 0 top
R75  100K  [R0805]  113.47,107.95 0 top
R76  220R  [R0805]  62.1,132.72 90 top
R77  220R  [R0805]  69.91,132.72 90 top
R78  1K  [R0805]  41.85,122.94 180 top
R79  220R  [R0805]  73.85,132.72 90 top
R80  220R  [R0805]  65.98,132.72 90 top
R81  10R  [R1206]  74.42,146.18 180 top
R82  10K  [R0805]  86.68,126.17 90 top
R83  330R  [R0805]  39.43,101.28 90 top
R84  5K1  [R0805]  92.65,138.62 270 top
R85  47K  [R0805]  91.25,124.78 270 top
R86  47K  [R0805]  39.75,140.91 90 top
R87  47K  [R0805]  36.77,141.92 0 top
R88  5K6  [R0805]  90.68,138.62 90 top
R89  750R  [R0805]  33.72,98.04 0 top
R90  2K2  [R0805]  93.22,124.78 90 top
R91  10K  [R0805]  101.54,130.87 0 top
R92  1K  [R0805]  30.54,135.7 180 top
R93  2K2  [R0805]  30.54,133.73 0 top
R94  10K  [R0805]  43.75,146.05 0 top
R95  10K  [R0805]  33.78,140.91 270 top
R96  750R  [R0805]  37.91,132.72 180 top
R97  5K1  [R0805]  95.95,138.62 270 top
R98  10K  [R0805]  100.52,127.89 90 top
R99  5K6  [R0805]  97.92,138.62 90 top
R100  47K  [R0805]  36.32,145.86 90 top
R101  330R  [R0805]  40.83,135.7 270 top
R102  10K  [R0805]  66.04,107.06 0 top
R103  18-22R/7W  [R_0913]  27.68,10.54 270 top
R104  330R/2W  [R2512]  15.94,6.73 270 top
R105  330R/2W  [R2512]  19.87,6.73 270 top
R106  2K2  [R0805]  52.64,5.97 0 top
R107  2K2  [R0805]  39.11,20.64 90 top
R108  330R/2W  [R2512]  66.29,16.19 270 top
R109  49R9  [R0805]  82.49,15.11 270 top
R110  220R  [R0805]  84.45,15.11 90 top
R111  330R/2W  [R2512]  66.29,6.67 90 top
R112  49R9  [R0805]  83.5,7.11 0 top
R113  220R  [R0805]  84.45,10.29 90 top
R114  1K  [R0805]  91.88,44.7 270 top
R115  5K6  [R0805]  93.85,44.7 270 top
R116  100R  [R0805]  99.12,60.45 270 top
R117  5K6  [R0805]  88.45,44.7 90 top
R118  220R  [R0805]  85.91,50.8 180 top
R119  2K2  [R0805]  99.12,56.52 90 top
R120  1K  [R0805]  102.55,56.52 90 top
R121  10K  [R0805]  95.82,44.7 90 top
R122  10K  [R0805]  86.49,44.7 270 top
R123  100K  [R0805]  78.99,30.04 180 top
R124  22R  [R0805]  45.53,65.79 180 top
R125  22R  [R0805]  45.53,67.75 180 top
R126  4K7  [R0805]  212.47,12.76 0 top
R127  4K7  [R0805]  167.21,13.73 270 top
R128  4K7  [R0805]  167.96,55.5 90 top
R129  1R  [R0805]  194.31,25.97 270 top
R130  1K8  [R0805]  173.1,65.98 0 top
R131  4K7  [R0805]  128.84,65.28 0 top
R132  1R  [R0805]  133.79,45.59 90 top
R133  4K7  [R0805]  283.6,29.34 90 top
R134  180R  [R0805]  319.92,49.15 270 top
R135  100K  [R0805]  314.84,60.77 180 top
R136  4K7  [R0805]  295.16,27.88 90 top
R136A  1R  [R0805]  186.82,6.43 0 top
R137  4K7  [R0805]  280.11,27.18 90 top
R138  49R9  [R0805]  244.99,19.3 180 top
R139  10K  [R0805]  328.6,42.48 270 top
R140  49R9  [R0805]  244.99,17.34 0 top
R140A  1R  [R0805]  147.95,4.45 0 top
R141  49R9  [R0805]  244.99,15.37 180 top
R142  49R9  [R0805]  244.99,13.4 0 top
R143  10R  [R1206]  330.15,19.18 270 top
R144  12K4  [R0805]  253.57,9.21 0 top
R145  10K  [R0805]  329.12,30.09 270 top
R146  100K  [R0805]  330.15,26.8 180 top
R147  180R  [R0805]  248.93,5.02 180 top
R148  180R  [R0805]  248.93,3.05 180 top
R149  10K  [R0805]  263.73,4.76 90 top
R150  180R  [R0805]  214.31,49.47 0 top
R151  1K8  [R0805]  228.41,57.02 0 top
R152  750R  [R0805]  198.5,52.2 0 top
R153  750R  [R0805]  202.5,52.2 0 top
R154  47K  [R0805]  302.21,31.31 180 top
R155  100R  [R0805]  193.48,63.25 180 top
R156  4K7  [R0805]  274.14,29.27 90 top
R157  10K  [R0805]  272.17,29.27 90 top
R158  47K  [R0805]  298.08,31.31 180 top
R159  4K7  [R0805]  263.6,28.64 90 top
R160  n.c.  [R0805]  292.43,32.07 270 top
R161  4K7  [R0805]  199.9,41.4 0 top
R162  4K7  [R0805]  195.96,41.4 0 top
R163  1K  [R0805]  203.58,63.63 180 top
R164  1K  [R0805]  212.28,64.96 270 top
R165  10K  [R0805]  265.57,28.64 90 top
R166  220R  [R0805]  127.89,15.24 180 top
R167  n.c.  [R1206]  156.65,133.6 180 bottom
R168  12K  [R1206]  168.72,125.73 0 top
R169  20K  [R0805]  328.61,54.99 270 top
R170  1K  [R0805]  332.55,38.8 270 top
R171  1K  [R0805]  332.55,42.74 270 top
R172  10K  [R0805]  328.61,50.36 270 top
R173  10K  [R0805]  334.52,48.83 270 top
R174  47K  [R0805]  330.58,47.82 270 top
R175  20K  [R0805]  334.58,54.36 270 top
R176  1M  [R0805]  275.59,12 90 top
R177  220R  [R0805]  208.72,41.4 180 top
R179  0R75?  [R1206]  46.16,92.71 270 top
R180  47K  [R0805]  40.83,93.54 180 top
RN1  4x10K  [CAY16]  263.79,18.86 0 top
RN2  4x10K  [CAY16]  260.17,18.86 0 top
SAR1  CG2-470L  [SAR]  18.92,27.47 180 top
SH1  Pgnd to Pout- short  [SHORT_NOHOLE]  124.84,82.93 180 top
SH2  Sgnd to Pgnd short  [SHORT_NOHOLE]  124.78,82.74 270 top
SH3  [SHORT_NOHOLE]  259.28,10.35 180 top
SP1  LD-BZEN-0903  [LD-BZEN-0903]  303.03,64.14 0 top
SP2  LD-BZEN-0903  [LD-BZEN-0903]  331.41,66.42 180 bottom
SW1  A101SYCQ04  [M9040P]  331.52,10 0 bottom
SW2  PEC12R-4225F-S0024  [EC12E_SW]  224,62 270 bottom
SW3  1301.9316  [TACTM-6XN]  293,4 180 bottom
TR1  VTX-214-005-0512  [PCB_ACDC_VTX_5W_DUAL]  46.1,38.23 270 top
U$1  [RECYCLE_BIN1/8]  31.25,17.53 0 top
U$2  [RECYCLE_BIN1/8]  154.25,106.36 0 top
U$3  [PB_SMALL]  152.59,109.6 0 top
U$4  [ESD_SYMBOL]  151.61,113.39 0 top
U$5  [PB_SMALL]  29.09,20.64 0 top
U$6  [ESD_SYMBOL]  20.48,17.44 0 top
U$7  [ESD_SYMBOL]  229.9,44.3 0 top
U$8  [RECYCLE_BIN1/8]  242.26,44.45 0 top
U$9  [PB_SMALL]  239.14,47.63 0 top
VAR1  ERZE14A431  [VARISTOR]  18.41,39.37 0 top
VAR2  ERZE14A431  [VARISTOR]  18.41,34.35 180 top
VAR3  ERZE11A431  [VARISTOR_13MM]  107.76,10.86 180 top
VAR4  ERZE11A431  [VARISTOR_13MM]  106.81,40.01 0 top
X1  39-30-1039  [MINIFIT_39301039]  171.13,81.6 180 bottom
X2  SSW-113-02-T-D-RA  [SSW-113-02-T-D-RA]  27.51,97.83 90 top
X3  39303055  [MINIFIT_6659-5]  13.27,61.72 0 top
X4  22-23-2031  [22-23-2031]  109.98,47.94 270 top
X5  09185067324  [IDC-10PIN]  74.04,40.64 180 top
X6  CTB9300/3A + CTB92VG/3S  [WR-TBL_3-PIN]  106.5,17 0 bottom
X7  Amphenol: LMJ2138812S0LOT6C or WE: 74990101210  [RJ45-VERT]  79.54,59.12 180 bottom
X8  826629-8  [HEADER_8-PIN]  79.12,71.12 0 top
X9  826629-5  [SSW-105-02-S-S]  48.89,71.12 180 top
X10  826629-5  [SSW-105-02-S-S]  30.16,71.12 180 top
X11  2411-01  [KUSBVX-BS1N]  54.74,59.12 0 bottom
X12  MC000006  [MC000006_MIRROR]  197,34 180 top
X13  TSW-113-07-F-D  [TSW-113-07-F-D]  190.25,21.83 90 top
X14  MC000006  [MC000006_MIRROR]  124,34 180 top
X15  TSW-113-07-F-D  [TSW-113-07-F-D]  149.25,52.17 270 top
X16  09185067324  [IDC-10PIN]  307.35,5.21 0 top
X17  22-23-2021  [22-23-2021]  281.11,16.13 0 top
X18  MC34753  [HEADER_8-PIN]  241.06,12.32 90 top
X19  282836-2  [TBLOCK5.0_2]  174.37,141.54 180 bottom
X20  PCA-6B-20-HL-3 or 52746-2071  [FPC-20_ROTATED]  237.87,46.35 270 bottom
Y1  32.768kHz  [R26_XTAL]  286.33,50.42 0 top
Y2  25MHz  [HC-49/4H]  271.92,11.18 270 top
ZD1  SMAJ51A  [DO214AA]  161.61,105.98 270 top
ZD2  BZX384-C15  [SOD323-W]  90.23,81.85 0 top
ZD3  PDZ6.2B  [SOD323-W]  86.68,96.77 90 top
ZD4  1.5KE400CA  [DO201-BIDIR]  11.96,14.71 0 top
ZD5  1.5KE400CA  [DO201-BIDIR]  11.9,20.24 0 top
ZD6  SMAJ18A  [DO214AC]  83.06,32 270 top
ZD7  P4SMAJ48A  [DO214AC]  184.72,29.15 90 top
ZD8  SMAJ18A  [DO214AC]  170.64,18.73 180 top
ZD9  SMAJ18A  [DO214AC]  164.27,50.48 180 top
ZD10  P4SMAJ48A  [DO214AC]  145.99,47.67 270 top
ZD11  SMAJ18A  [DO214AC]  211.77,31.62 180 top
ZD12  SMAJ18A  [DO214AC]  140.41,31.56 180 top
ZD13  4V3  [MINIMELF]  193.48,65.6 180 top
ZD14  SMAJ18A  [DO214AC]  123.76,29.27 90 top
ZD15  n.c.  [DO214AA]  169.48,144.02 270 top
ZD16  PDZ5.6B  [SOD323-W]  96.2,145.86 180 top

## Tracks (layer width: path | path; a pad name or v marks a point on that pad's centre or on a via)
0V  (via drill 0.6)  (1 unrouted)
  Top 0.254: C77.2 66.93,50.93 67.12,51.12 | R121.2 v95.82,46.67 | Q24.2 v96.27,41.85
  Top 0.406: R120.1 v102.55,54.48 | R119.1 v99.12,54.48 | v105.54,62.93 105.54,64.12 Q23.3
  Top 1.27: TR1.5 41.1,48.28 43.94,51.12 67.12,51.12 69.15,51.12 72.77,47.5 92.84,47.5
  Bottom 0.254: v96.27,41.85 96.27,44.39
  other vias: 106.49,62.93 92.2,47.5 93.15,47.5
  pour Bottom (isolate 0.305): 91.82,64.14 114.36,64.14 114.36,44.13 91.82,44.13
1V2O
  Top 0.254: IC26.22 263.25,8.42 263.47,8.64 264.62,8.64 265.19,8.06 265.19,6.16 265.63,5.71 C131.2
!ADC1_SELECT  (via drill 0.6)
  Top 0.254: IC20.4 227.33,33.02 228.6,31.75 249.17,31.75 249.43,32 254.32,32 254.95,32.64 262.19,32.64 263.33,33.78 273.18,33.78 v273.56,34.16
  Bottom 0.254: MCU.15 274.14,70.41 274.14,34.75 v273.56,34.16
!ADC2_SELECT  (via drill 0.6)  (1 unrouted)
  Top 0.254: IC23.4 154.37,68.52 155.32,69.47 176.97,69.47 177.8,68.64 181.42,68.64 182.24,69.47 217.61,69.47 221.49,65.6 223.52,65.6 223.9,65.22 227.71,65.22 229.68,63.25 233.04,63.25 234,62.29 245.24,62.29 v245.55,61.91
  Bottom 0.254: 252.28,35.88 251.08,37.08 249.17,37.08 248.61,37.64 248.61,38.91 245.94,41.59 245.94,61.53 v245.55,61.91
!BP_OE  (via drill 0.6)
  Top 0.254: v240.73,72.58 241.17,73.01 308.09,73.01 MCU.10 | IC18.21 178.07,64.95 176.85,66.17 176.85,66.86 177.54,67.56 181.86,67.56 182.75,68.45 191.26,68.45 191.77,67.94 v191.96,67.94
  Bottom 0.254: v240.73,72.58 240.28,73.03 197.04,73.03 v191.96,67.94
!BP_OUT0  (via drill 0.6)
  Top 0.254: IC18.5 178.68,56.76 177.86,55.94 173.04,55.94 170.5,58.48 169.35,58.48 165.42,62.42 v165.42,62.99
  Bottom 0.254: LED_CV1.C 133.51,59.44 139.7,59.44 142.43,62.17 164.59,62.17 v165.42,62.99
!BP_OUT1  (via drill 0.6)
  Top 0.254: IC18.6 179.34,56.02 180.75,54.61 183.26,54.61 185.93,57.28 209.87,57.28 v210.38,57.66 | Q26.1 211.53,15.16 211.26,15.43 v211.01,15.43
  Top 0.406: Q26.1 211.53,12.77 R126.1
  Bottom 0.254: v211.01,15.43 211.01,44.96 210.38,45.59 v210.38,57.66
!BP_OUT2  (via drill 0.6)
  Top 0.254: IC18.7 179.94,56.66 181.04,55.56 v182.24,55.56 | v192.47,22.48 v192.47,27.18
  Bottom 0.254: LED_O1.C 187.34,18.41 188.17,19.24 191.71,19.24 192.47,20 v192.47,22.48 | v192.47,27.18 192.47,31.94 191.13,33.27 186.31,33.27 185.55,34.04 185.55,52.26 v182.24,55.56
!BP_OUT3  (via drill 0.6)
  Top 0.254: IC18.8 180.61,57.33 v181.16,56.77
  Bottom 0.254: v181.16,56.77 181.16,55.24 184.91,51.5 184.91,33.15 170.05,18.29 LED_SP.C
!BP_OUT4  (via drill 0.6)
  Top 0.254: IC18.9 181.22,59.3 181.55,59.63 201.36,59.63 201.87,60.13 210.82,60.13 v211.2,59.75
  Bottom 0.254: LED_PROG1.C 214.55,55.77 211.2,59.12 v211.2,59.75
!BP_OUT5  (via drill 0.6)
  Top 0.254: IC18.10 181.88,57.33 182.81,56.39 184.21,56.39 185.67,57.85 202.37,57.85 v202.75,58.23
  Bottom 0.254: LED_S1.C 202.82,49.13 202.82,58.17 v202.75,58.23
!BP_OUT6  (via drill 0.6)
  Top 0.254: IC18.11 182.49,57.54 183.01,57.02 184.02,57.02 185.42,58.42 201.68,58.42 202.37,59.12 203.14,59.12 204.09,58.17 v207.33,58.17
  Bottom 0.305: LED_CC1.C 207.05,58.02 v207.33,58.17
!BP_OUT7  (via drill 0.6)
  Top 0.254: IC18.12 183.15,58.94 183.2,58.99 201.48,58.99 202.12,59.63 203.9,59.63 v204.28,59.24
  Bottom 0.254: v204.28,59.24 204.95,59.92 LED_CV2.C
!BP_OUT8  (via drill 0.6)
  Top 0.254: IC18.13 v184.09,63.75 | 168.94,14.97 168.93,14.99 | 167.5,14.97 168.94,14.97 | 168.98,14.97 Q28.1 | 168.94,14.97 168.98,14.97 | 168.98,14.97 168.99,14.99 169.8,14.99 169.86,15.05 169.86,17.34 170.31,17.78 170.31,22.23 v169.8,22.73
  Top 0.305: 167.5,14.97 R127.1
  Bottom 0.254: v169.8,22.73 184.21,37.15 184.21,51.37 180.21,55.37 180.21,58.04 183.83,61.66 183.83,63.5 v184.09,63.75
!BP_OUT9  (via drill 0.6)
  Top 0.254: IC18.14 182.49,62.5 v182.94,62.04 | R128.1 168.85,54.55 v169.1,54.8
  Top 0.406: Q27.1 167.84,54.43 R128.1
  Bottom 0.254: v182.94,62.04 182.94,61.53 179.64,58.23 179.64,55.05 177.99,53.4 171.77,53.4 170.37,54.8 v169.1,54.8
!BP_OUT10  (via drill 0.6)
  Top 0.254: IC18.15 181.88,65.35 v181.93,65.41
  Bottom 0.254: v181.93,65.41 181.86,65.41 180.97,66.29 180.15,66.29 179.64,65.79 179.64,65.22 177.29,62.87 172.85,62.87 171.58,61.59 142.68,61.59 135.09,54 LED_CC2.C 134.1,53.95
!BP_OUT12  (via drill 0.6)
  Top 0.254: IC18.17 180.61,65.39 v180.59,65.41
  Bottom 0.254: v180.59,65.41 177.54,62.36 173.1,62.36 171.77,61.02 142.94,61.02 131.95,50.04 LED_S2.C
!BP_OUT13  (via drill 0.6)  (1 unrouted)
  Top 0.254: v154.56,37.27 154.56,50.48 156.84,52.77 160.46,52.77 161.8,54.1 161.8,56.33 163.57,58.1 v163.57,58.93 | IC18.18 179.96,62.67 178.69,61.4 176.91,61.4 v176.4,60.9
  Bottom 0.254: v154.56,37.27 153.29,36.01 153.29,20.64 151.83,19.18 150.13,19.18 LED_O2.C 149.08,18 | v163.57,58.93 164.46,59.82 172.08,59.82 173.48,61.21 176.08,61.21 v176.4,60.9
!BP_OUT14  (via drill 0.6)
  Top 0.254: v178.94,71.06 178.5,71.5 142.3,71.5 v141.54,70.74 | IC18.19 179.34,64.72 179.7,65.09 179.7,66.17 179.32,66.55 v177.8,66.55 | R131.1 Q29.1 127.9,70.81 128.05,70.96 128.14,71.06 129.22,72.14 134.24,72.14 v135.44,70.93
  Bottom 0.254: v178.94,71.06 178.94,67.69 v177.8,66.55 | v135.44,70.93 141.35,70.93 v141.54,70.74
!BP_OUT15  (via drill 0.6)
  Top 0.254: v180.28,71.06 180.72,71.5 238.25,71.5 243.2,66.55 v243.71,66.55 | v178.69,65.6 178.69,63.77 IC18.20 | v314.02,34.04 313.76,34.04 312.56,35.24 311.54,35.24 311.04,35.75 289.89,35.75 288.18,37.47 256.6,37.47 256.28,37.15 249.06,37.15 v247.66,38.54 | v316.75,24.32 327.03,24.32 v328.62,22.73
  Bottom 0.254: v178.69,65.6 178.69,65.66 178.81,65.79 178.81,66.74 179.51,67.44 179.51,70.29 v180.28,71.06 | v314.02,34.04 314.02,32.7 314.65,32.07 314.65,29.91 315.99,28.57 315.99,27.5 317.12,26.36 317.12,24.7 316.75,24.33 v316.75,24.32 | v243.71,66.55 243.71,62.48 245.43,60.77 245.43,41.34 247.66,39.1 v247.66,38.54 | LED_PWR.C 330.47,21.14 330.09,21.14 330.09,21.27 v328.62,22.73
!CH1_ADC  (via drill 0.6)  (1 unrouted)
  Top 0.254: IC20.13 219.52,33.02 v219.26,32.83 | 187.71,47.24 188.97,48.51 190.75,48.51 191.51,47.75 191.51,46.93 193.8,44.64 215.84,44.64 v216.34,44.13
  Bottom 0.254: v219.26,32.83 218.88,33.21 218.88,38.73 216.66,40.96 216.66,43.81 v216.34,44.13
!CH1_DAC  (1 unrouted)
  Top 0.254: IC19.12 218.57,47.82 217.11,46.35 195.77,46.35 195.01,47.12 193.8,47.12 191.64,49.28 191.64,50.16 190.75,51.05 188.97,51.05 187.71,49.78
!CH1_EXPANDER  (1 unrouted)
  Top 0.254: 219.2,46.55 218.44,46.55 217.68,45.78 195.52,45.78 194.75,46.55 193.55,46.55 190.32,49.77 X13.3
!CH1_INT
  Top 0.254: IC20.11 219.77,35.56 218.88,36.45 218.88,38.29 213.68,43.5 193.29,43.5 190.82,45.97 189,45.97 X13.8
!CH1_RESET  (via drill 0.6)
  Top 0.254: IC20.14 v218.44,31.75 | X13.5 190.39,47.23 193.55,44.07 214.5,44.07 v215.33,43.24
  Bottom 0.254: v218.44,31.75 218.31,31.88 218.31,38.48 216.09,40.7 216.09,42.48 v215.33,43.24
!CH2_ADC  (via drill 0.6)
  Top 0.254: X15.6 151.57,26.8 150.3,28.07 148.02,28.07 147.13,27.18 137.41,27.18 136.65,26.42 135.89,26.42 v134.94,27.37 135.13,27.18 | IC23.13 154.37,60.33 150.81,56.77 145.99,56.77 143.51,54.29 121.86,54.29 120.33,55.82 v119.19,55.82
  Bottom 0.254: v119.19,55.82 118.81,55.44 118.81,31.43 122.49,27.75 130.49,27.75 131.25,26.99 134.56,26.99 v134.94,27.37
!CH2_DAC  (via drill 0.6)
  Top 0.254: IC21.12 136.78,60.26 135.44,58.93 123.44,58.93 v123.38,58.86 | X15.4 151.64,24.26 150.37,22.99 148.78,22.99 148.14,23.62 136.59,23.62 131.82,28.38 v131.82,28.51
  Bottom 0.254: v123.38,58.86 123.38,57.85 119.95,54.42 119.95,31.94 123,28.89 131.44,28.89 v131.82,28.51
!CH2_EXPANDER  (via drill 0.6)
  Top 0.254: IC21.13 138.05,59.69 136.4,58.04 124.39,58.04 v124.33,57.98 | v132.9,29.27 133.09,29.08 133.09,27.94 136.81,24.23 X15.3
  Bottom 0.254: v124.33,57.98 120.52,54.17 120.52,32.19 123.25,29.46 132.71,29.46 v132.9,29.27
!CH2_INT  (via drill 0.6)
  Top 0.254: IC21.11 135.51,60.26 135.06,59.82 v122.49,59.82 | X15.8 151.12,29.34 149.86,30.61 148.91,30.61 146.62,28.32 v134.05,28.32
  Bottom 0.254: v122.49,59.82 122.43,59.75 122.43,57.72 119.38,54.67 119.38,31.69 122.75,28.32 130.68,28.32 131.44,27.56 133.28,27.56 v134.05,28.32
!CH2_RESET  (via drill 0.6)
  Top 0.254: IC23.14 155.64,60.77 151.06,56.2 146.24,56.2 143.76,53.72 123.95,53.72 v123.57,53.34 | X15.5 149.25,26.9 149.22,26.92 147.7,26.92 147.38,26.61 138.18,26.61 v137.79,26.23
  Bottom 0.254: v123.57,53.34 122.24,52.01 122.24,32.96 124.01,31.18 129.67,31.18 130.3,31.81 134.62,31.81 137.79,28.64 v137.79,26.23
!CONVEND1  (via drill 0.6)  (1 unrouted)